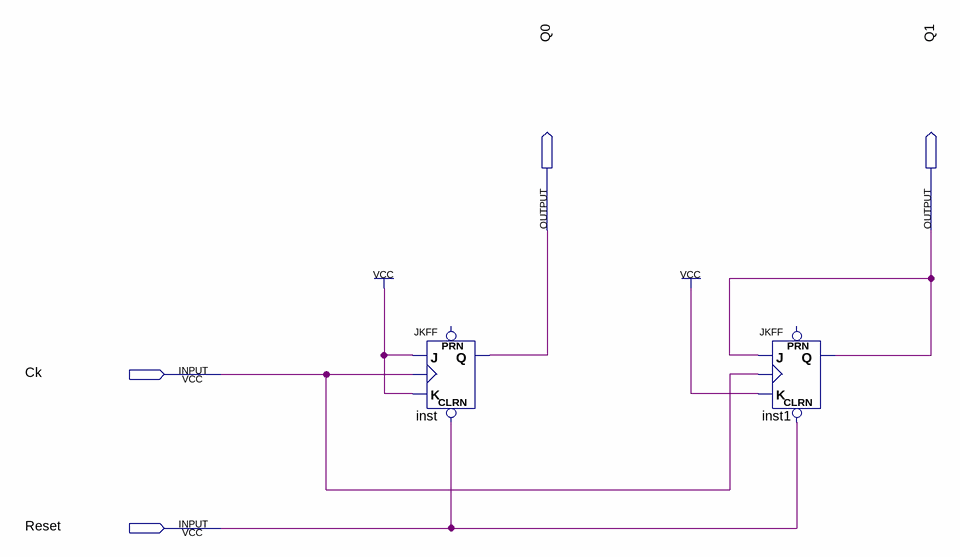
[diagram p0: schematic sheet]
// Quartus schematic Num0_1.bdf as structural Verilog: 2 symbols, 4 pins
module Num0_1 (
  input  Ck,
  input  Reset,
  output Q0,
  output Q1
);

  JKFF inst (.CLRN(Reset), .K(1'b1), .J(1'b1), .CLK(Ck), .Q(Q0));  // open: PRN
  JKFF inst1 (.CLRN(Reset), .K(1'b1), .J(Q1), .CLK(Ck), .Q(Q1));  // open: PRN
endmodule
